# EAGLE design sequencer_main (EAGLE 8.2.2)
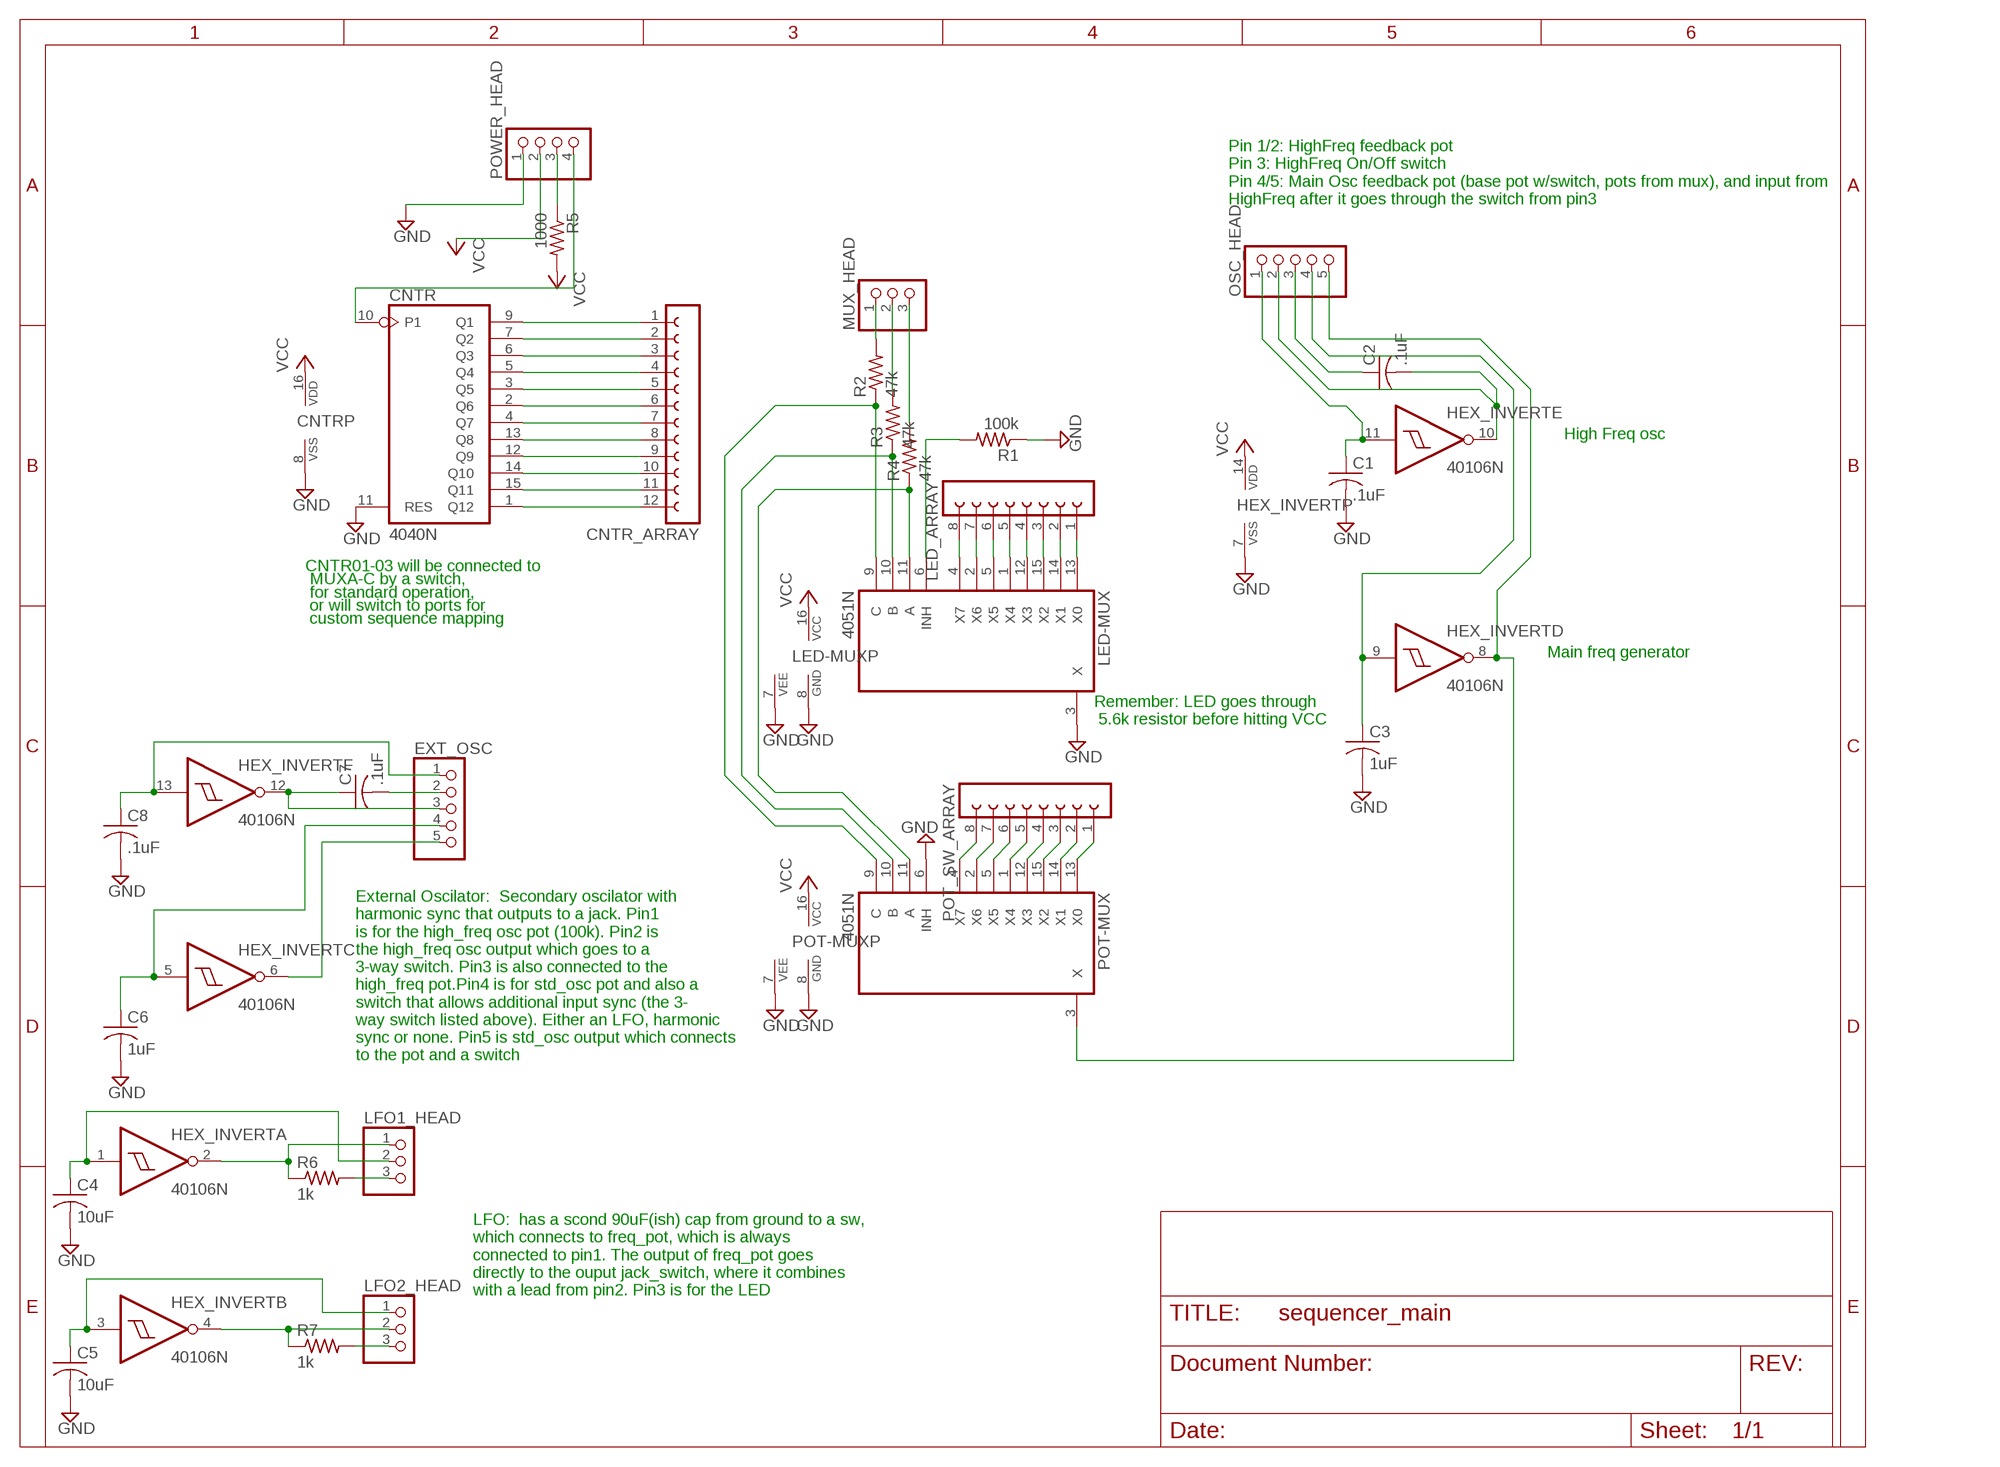
[diagram p0: schematic, sheet 1]

## Parts
C1  .1uF  C-US025-025X050  [C025-025X050]
C2  .1uF  C-US025-025X050  [C025-025X050]
C3  1uF  C-US025-025X050  [C025-025X050]
C4  10uF  C-US025-025X050  [C025-025X050]
C5  10uF  C-US025-025X050  [C025-025X050]
C6  1uF  C-US025-025X050  [C025-025X050]
C7  .1uF  C-US025-025X050  [C025-025X050]
C8  .1uF  C-US025-025X050  [C025-025X050]
CNTR  4040N  [DIL16]
CNTR_ARRAY  FE12-1  [FE12]
EXT_OSC  PINHD-1X5  [1X05]
HEX_INVERT  40106N  [DIL14]
LED-MUX  4051N  [DIL16]
LED_ARRAY  FE08-1  [FE08]
LFO1_HEAD  PINHD-1X3  [1X03]
LFO2_HEAD  PINHD-1X3  [1X03]
MUX_HEAD  PINHD-1X3  [1X03]
OSC_HEAD  PINHD-1X5  [1X05]
POT-MUX  4051N  [DIL16]
POT_SW_ARRAY  FE08-1  [FE08]
POWER_HEAD  PINHD-1X4  [1X04]
R1  100k  R-US_0204/7  [0204/7]
R2  47k  R-US_0204/7  [0204/7]
R3  47k  R-US_0204/7  [0204/7]
R4  47k  R-US_0204/7  [0204/7]
R5  1000  R-US_0204/7  [0204/7]
R6  1k  R-US_0204/7  [0204/7]
R7  1k  R-US_0204/7  [0204/7]

## Nets
GND: C1.2 C3.2 C4.2 C5.2 C6.2 C8.2 CNTR.8(VSS) CNTR.11(RES) HEX_INVERT.7(P:VSS) LED-MUX.3(X) LED-MUX.7(VEE) LED-MUX.8(GND) POT-MUX.6(INH) POT-MUX.7(VEE) POT-MUX.8(GND) POWER_HEAD.1 R1.1
N$1: LED-MUX.13(X0) LED_ARRAY.1
N$2: LED-MUX.14(X1) LED_ARRAY.2
N$3: LED-MUX.15(X2) LED_ARRAY.3
N$4: LED-MUX.12(X3) LED_ARRAY.4
N$5: LED-MUX.1(X4) LED_ARRAY.5
N$6: LED-MUX.5(X5) LED_ARRAY.6
N$7: LED-MUX.2(X6) LED_ARRAY.7
N$8: LED-MUX.4(X7) LED_ARRAY.8
N$9: LED-MUX.9(C) POT-MUX.9(C) R2.1
N$10: LED-MUX.10(B) POT-MUX.10(B) R3.1
N$11: LED-MUX.11(A) POT-MUX.11(A) R4.1
N$12: CNTR.10(P1) POWER_HEAD.4
N$13: CNTR.9(Q1) CNTR_ARRAY.1
N$14: CNTR.7(Q2) CNTR_ARRAY.2
N$15: CNTR.6(Q3) CNTR_ARRAY.3
N$16: CNTR.5(Q4) CNTR_ARRAY.4
N$17: CNTR.3(Q5) CNTR_ARRAY.5
N$18: CNTR.2(Q6) CNTR_ARRAY.6
N$19: CNTR.4(Q7) CNTR_ARRAY.7
N$20: CNTR.1(Q12) CNTR_ARRAY.12
N$21: CNTR.15(Q11) CNTR_ARRAY.11
N$22: CNTR.14(Q10) CNTR_ARRAY.10
N$23: CNTR.12(Q9) CNTR_ARRAY.9
N$24: CNTR.13(Q8) CNTR_ARRAY.8
N$25: MUX_HEAD.1 R2.2
N$26: MUX_HEAD.2 R3.2
N$27: MUX_HEAD.3 R4.2
N$28: LED-MUX.6(INH) R1.2
N$29: POT-MUX.4(X7) POT_SW_ARRAY.8
N$30: POT-MUX.2(X6) POT_SW_ARRAY.7
N$31: POT-MUX.5(X5) POT_SW_ARRAY.6
N$32: POT-MUX.1(X4) POT_SW_ARRAY.5
N$33: POT-MUX.12(X3) POT_SW_ARRAY.4
N$34: POT-MUX.15(X2) POT_SW_ARRAY.3
N$35: POT-MUX.14(X1) POT_SW_ARRAY.2
N$36: POT-MUX.13(X0) POT_SW_ARRAY.1
N$37: POWER_HEAD.3 R5.1
N$38: C3.1 HEX_INVERT.9(D:I) OSC_HEAD.4
N$39: C1.1 HEX_INVERT.11(E:I) OSC_HEAD.1
N$40: C2.2 HEX_INVERT.10(E:O) OSC_HEAD.2
N$41: HEX_INVERT.8(D:O) OSC_HEAD.5 POT-MUX.3(X)
N$42: C7.2 EXT_OSC.2
N$43: HEX_INVERT.2(A:O) LFO1_HEAD.1 R6.1
N$44: LFO1_HEAD.3 R6.2
N$45: C4.1 HEX_INVERT.1(A:I) LFO1_HEAD.2
N$46: HEX_INVERT.4(B:O) LFO2_HEAD.2 R7.1
N$47: C5.1 HEX_INVERT.3(B:I) LFO2_HEAD.1
N$48: LFO2_HEAD.3 R7.2
N$49: C2.1 OSC_HEAD.3
N$50: C8.1 EXT_OSC.1 HEX_INVERT.13(F:I)
N$51: C6.1 EXT_OSC.4 HEX_INVERT.5(C:I)
N$52: C7.1 EXT_OSC.3 HEX_INVERT.12(F:O)
N$53: EXT_OSC.5 HEX_INVERT.6(C:O)
VCC: CNTR.16(VDD) HEX_INVERT.14(P:VDD) LED-MUX.16(VCC) POT-MUX.16(VCC) POWER_HEAD.2 R5.2

## Notes on the sheet
- Pin 1/2: HighFreq feedback pot
  Pin 3: HighFreq On/Off switch
  Pin 4/5: Main Osc feedback pot (base pot w/switch, pots from mux), and input from 
  HighFreq after it goes through the switch from pin3
- High Freq osc
- CNTR01-03 will be connected to
   MUXA-C by a switch,
   for standard operation,
   or will switch to ports for
   custom sequence mapping
- Main freq generator
- Remember: LED goes through
   5.6k resistor before hitting VCC
- External Oscilator:  Secondary oscilator with
  harmonic sync that outputs to a jack. Pin1
  is for the high_freq osc pot (100k). Pin2 is 
  the high_freq osc output which goes to a 
  3-way switch. Pin3 is also connected to the
  high_freq pot.Pin4 is for std_osc pot and also a
  switch that allows additional input sync (the 3-
  way switch listed above). Either an LFO, harmonic
  sync or none. Pin5 is std_osc output which connects
  to the pot and a switch
- LFO:  has a scond 90uF(ish) cap from ground to a sw,
  which connects to freq_pot, which is always
  connected to pin1. The output of freq_pot goes
  directly to the ouput jack_switch, where it combines
  with a lead from pin2. Pin3 is for the LED

## Library data of the parts
C1-C8 = resistor:C-US: CAPACITOR, American symbol
CNTR = 40xx:4040: 12-stage binary/ripple COUNTER
CNTR_ARRAY = con-lsta:FE12-1: FEMALE HEADER; OC_FARNELL: unknown; OC_NEWARK: unknown
EXT_OSC OSC_HEAD = pinhead:PINHD-1X5: PIN HEADER
HEX_INVERT = 40xx:40106: Hex SCHMITT TRIGGER
LED-MUX POT-MUX = 40xx:4051: 8-channel ANALOG MULTIPLEXER
LED_ARRAY POT_SW_ARRAY = con-lsta:FE08-1: FEMALE HEADER; OC_FARNELL: unknown; OC_NEWARK: unknown
LFO1_HEAD LFO2_HEAD MUX_HEAD = pinhead:PINHD-1X3: PIN HEADER
POWER_HEAD = pinhead:PINHD-1X4: PIN HEADER
R1-R7 = resistor:R-US_: RESISTOR, American symbol

## Board
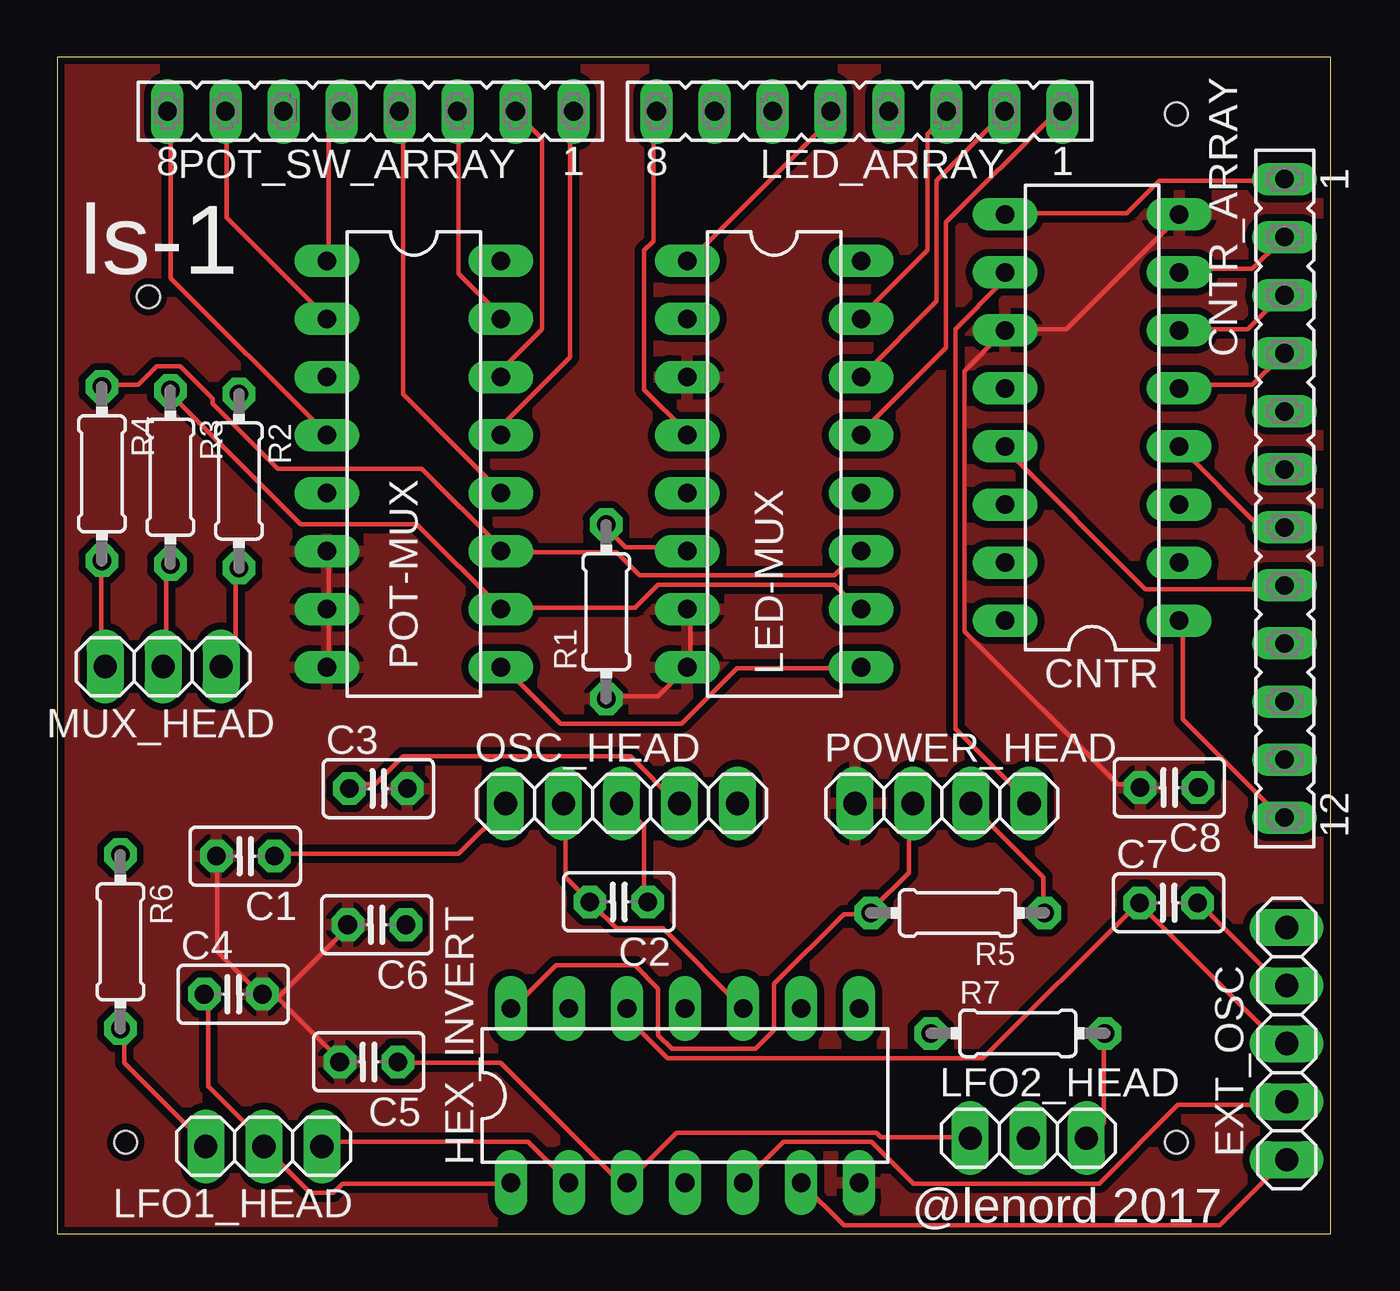
[diagram p1: board, top side]
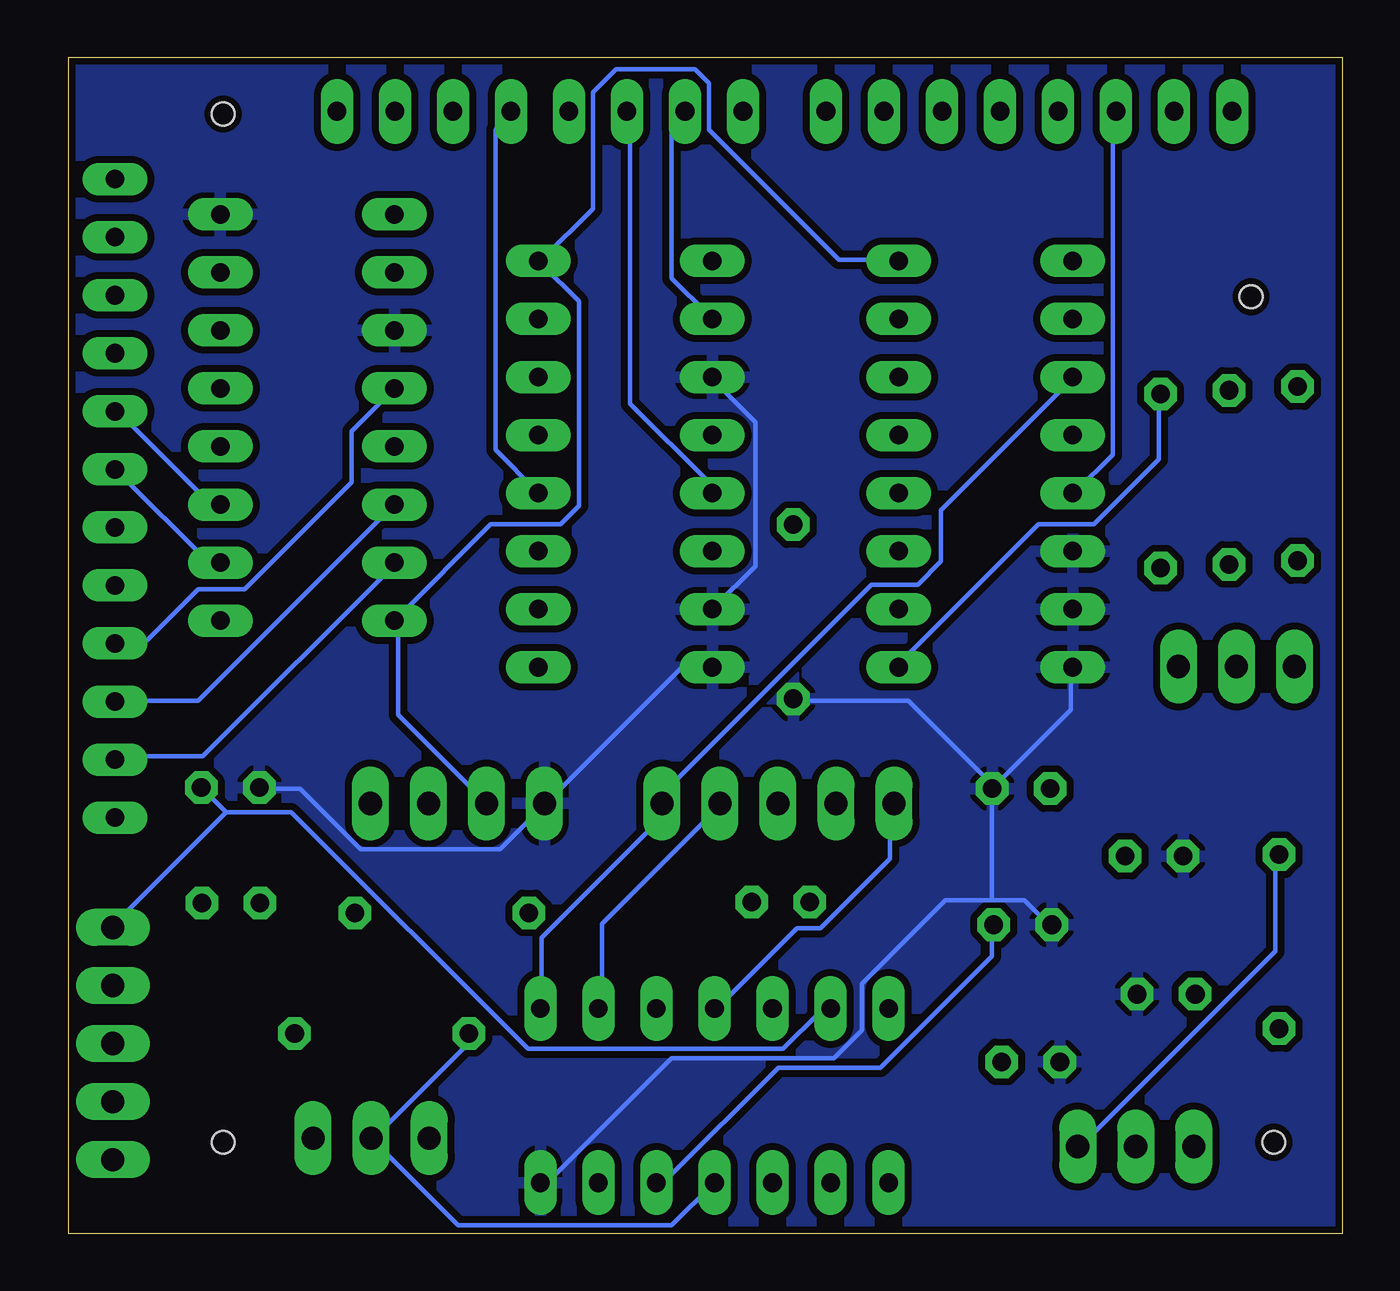
[diagram p2: board, bottom side, seen from below]

Size 55.76 x 51.49 mm. Coordinates in mm from the lower left corner, seen from the top.
Outline: 0,0 55.76,0 55.76,51.49 0,51.49 0,0
Copper layers (1*16): Top 0.035mm / dielectric 1.5mm / Bottom 0.035mm
Design rules "SparkFun": minimum track width 8mil, minimum drill 20mil, track to track 8mil, track to pad 8mil, pad to pad 8mil, via to via 8mil, smd to smd 8mil, copper to edge 8mil, drill to drill 8mil, minimum pad ring 12mil, minimum via ring 10mil, stop-mask expansion 4mil, vias tented up to drill 20mil, thermal gap 10mil
Holes 1 mm at 49,4 3,4 4,41 49,49

### Footprints (pad centres in the part's own frame; a part is rotated, then mirrored left to right if it is on the bottom)
C025-025X050 = drill 0.813 octagon: 1 -1.27,0; 2 1.27,0
DIL16 = drill 0.813 long: 1 -8.89,-3.81; 2 -6.35,-3.81; 3 -3.81,-3.81; 4 -1.27,-3.81; 5 1.27,-3.81; 6 3.81,-3.81; 7 6.35,-3.81; 8 8.89,-3.81; 9 8.89,3.81; 10 6.35,3.81; 11 3.81,3.81; 12 1.27,3.81; 13 -1.27,3.81; 14 -3.81,3.81; 15 -6.35,3.81; 16 -8.89,3.81
FE12 = drill 0.813 long: 1 -13.97,0; 2 -11.43,0; 3 -8.89,0; 4 -6.35,0; 5 -3.81,0; 6 -1.27,0; 7 1.27,0; 8 3.81,0; 9 6.35,0; 10 8.89,0; 11 11.43,0; 12 13.97,0
1X05 = drill 1.016 long: 1 -5.08,0; 2 -2.54,0; 3 0,0; 4 2.54,0; 5 5.08,0
DIL14 = drill 0.813 long: 1 -7.62,-3.81; 2 -5.08,-3.81; 3 -2.54,-3.81; 4 0,-3.81; 5 2.54,-3.81; 6 5.08,-3.81; 7 7.62,-3.81; 8 7.62,3.81; 9 5.08,3.81; 10 2.54,3.81; 11 0,3.81; 12 -2.54,3.81; 13 -5.08,3.81; 14 -7.62,3.81
FE08 = drill 0.813 long: 1 -8.89,0; 2 -6.35,0; 3 -3.81,0; 4 -1.27,0; 5 1.27,0; 6 3.81,0; 7 6.35,0; 8 8.89,0
1X03 = drill 1.016 long: 1 -2.54,0; 2 0,0; 3 2.54,0
1X04 = drill 1.016 long: 1 -3.81,0; 2 -1.27,0; 3 1.27,0; 4 3.81,0
0204/7 = drill 0.813 octagon: 1 -3.81,0; 2 3.81,0

### Placement (x,y rotation side)
C1  8.24,16.52 180 top
C2  24.59,14.52 180 top
C3  14.06,19.48 0 top
C4  7.71,10.48 0 top
C5  13.64,7.52 180 top
C6  13.99,13.52 180 top
C7  48.66,14.48 0 top
C8  48.69,19.52 180 top
CNTR  45.31,35.72 90 top
CNTR_ARRAY  53.74,32.18 270 top
EXT_OSC  53.83,8.32 270 top
HEX_INVERT  27.49,6.04 0 top
LED-MUX  31.39,33.68 270 top
LED_ARRAY  35.13,49.12 180 top
LFO1_HEAD  9.05,3.82 180 top
LFO2_HEAD  42.52,4.18 0 top
MUX_HEAD  4.64,24.82 180 top
OSC_HEAD  24.71,18.83 0 top
POT-MUX  15.62,33.68 270 top
POT_SW_ARRAY  13.72,49.12 180 top
POWER_HEAD  38.74,18.83 0 top
R1  24.04,27.22 90 top
R2  7.96,32.94 270 top
R3  4.96,33.1 270 top
R4  1.96,33.26 270 top
R5  39.42,14.04 180 top
R6  2.77,12.78 270 top
R7  42.06,8.77 0 top

### Tracks (layer width: path | path; a pad name or v marks a point on that pad's centre or on a via)
GND
  Top 0.203: R1.1 24.08,23.53 26.31,23.53 27.53,24.75 LED-MUX.8 27.74,24.95 27.74,27.19 LED-MUX.7 | CNTR.8 49.07,44.46 44.2,39.58 41.55,39.58 CNTR.11 41.35,39.38 39.73,37.75 39.73,26.37 46.43,19.67 47.24,19.67 C8.2 | POT-MUX.8 11.89,24.95 11.89,27.19 POT-MUX.7 11.89,27.39 11.89,29.83 POT-MUX.6 | 9.65,10.32 9.04,10.32 C4.2 | 9.65,10.32 12.29,7.68 C5.2 | C1.2 7.01,16.42 7.01,12.35 8.84,10.52 C4.2 | 9.65,10.32 12.7,13.37 C6.2 | 9.65,10.32 C4.2
  Bottom 0.203: LED-MUX.3 27.53,37.35 25.7,35.52 25.7,29.22 27.53,27.39 LED-MUX.7 | C8.2 47.24,19.46 45.62,19.46 42.98,16.82 36.88,16.82 35.05,18.65 POWER_HEAD.1 34.85,18.85 28.95,24.75 27.74,24.75 LED-MUX.8 | 15.34,14.59 13.92,14.59 12.9,13.57 C6.2 | 15.34,14.59 17.37,14.59 21.03,10.93 21.03,8.9 22.25,7.68 29.36,7.68 34.65,2.39 35.05,2.39 HEX_INVERT.7 | 15.34,14.59 15.34,19.46 C3.2 | POT-MUX.8 11.89,24.75 11.89,22.92 15.14,19.67 C3.2 | R1.1 23.88,23.33 19,23.33 15.34,19.67 C3.2
  pour Top (isolate 0.305): 0,0 56,0 56,51 0,51
  pour Bottom (isolate 0.305): 0,0 56,0 56,51 0,51
N$1
  Top 0.203: LED-MUX.13 35.25,35.11 38.91,38.77 38.91,44.25 43.59,48.93 43.99,48.93 LED_ARRAY.1
N$2
  Top 0.203: LED-MUX.14 35.25,37.55 38.51,40.8 38.51,46.08 41.35,48.93 LED_ARRAY.2
N$3
  Top 0.203: LED-MUX.15 35.25,40.19 38.1,43.03 38.1,48.12 38.91,48.93 LED_ARRAY.3
N$4
  Bottom 0.203: LED-MUX.12 35.25,32.47 37.08,34.3 37.08,48.32 36.47,48.93 LED_ARRAY.4
N$5
  Top 0.203: LED-MUX.1 27.74,42.63 34.03,48.93 LED_ARRAY.5
N$6
  Bottom 0.203: LED-MUX.5 27.74,32.47 27.74,32.88 31.19,36.33 31.19,48.93 LED_ARRAY.6
N$7
  Bottom 0.203: LED-MUX.2 27.74,40.19 29.36,41.82 29.36,48.52 28.95,48.93 LED_ARRAY.7
N$8
  Top 0.203: LED_ARRAY.8 26.11,48.93 26.11,43.44 25.7,43.03 25.7,36.94 27.53,35.11 LED-MUX.4
N$9
  Top 0.203: LED-MUX.9 35.05,24.75 29.77,24.75 27.33,22.31 22.05,22.31 19.61,24.75 POT-MUX.9
  Bottom 0.203: R2.1 8.03,36.74 8.03,33.89 10.87,31.05 13.31,31.05 19.41,24.95 POT-MUX.9
N$10
  Top 0.203: LED-MUX.10 35.05,27.39 34.03,28.41 26.31,28.41 25.3,27.39 19.61,27.39 POT-MUX.10 19.41,27.39 15.75,31.05 10.67,31.05 4.98,36.74 R3.1
N$11
  Top 0.203: LED-MUX.11 35.05,29.83 34.03,28.81 25.5,28.81 24.48,29.83 19.61,29.83 POT-MUX.11 19.41,30.03 15.95,33.48 9.65,33.48 6.81,36.33 6.81,36.53 5.38,37.95 4.37,37.95 3.55,37.14 2.13,37.14 R4.1
N$12
  Top 0.203: CNTR.10 41.35,42.02 41.35,41.61 39.32,39.58 39.32,22.11 42.57,18.85 POWER_HEAD.4
N$13
  Top 0.203: CNTR.9 41.55,44.66 46.84,44.66 48.26,46.08 53.54,46.08 CNTR_ARRAY.1
N$14
  Top 0.203: CNTR.7 49.28,42.22 52.32,42.22 53.54,43.44 CNTR_ARRAY.2
N$15
  Top 0.203: CNTR.6 49.28,39.58 52.12,39.58 53.54,41 CNTR_ARRAY.3
N$16
  Top 0.203: CNTR.5 49.28,37.14 52.32,37.14 53.54,38.36 CNTR_ARRAY.4
N$17
  Bottom 0.203: CNTR.3 49.28,32.06 49.68,32.06 53.54,35.92 CNTR_ARRAY.5
N$18
  Bottom 0.203: CNTR.2 49.28,29.42 49.68,29.42 53.54,33.28 CNTR_ARRAY.6
N$19
  Top 0.203: CNTR_ARRAY.7 53.54,31.05 52.53,31.05 49.28,34.3 CNTR.4
N$20
  Top 0.203: CNTR.1 49.28,26.78 49.28,22.51 53.54,18.25 CNTR_ARRAY.12
N$21
  Bottom 0.203: CNTR_ARRAY.11 53.54,20.89 49.89,20.89 41.55,29.22 CNTR.15
N$22
  Bottom 0.203: CNTR_ARRAY.10 53.54,23.33 50.09,23.33 41.55,31.86 CNTR.14
N$23
  Bottom 0.203: CNTR_ARRAY.9 53.54,25.97 52.32,25.97 50.09,28.2 48.06,28.2 43.38,32.88 43.38,35.11 41.55,36.94 CNTR.12
N$24
  Top 0.203: CNTR_ARRAY.8 53.54,28.2 47.65,28.2 41.55,34.3 CNTR.13
N$25
  Top 0.203: R2.2 7.82,29.01 7.82,25.56 7.21,24.95 MUX_HEAD.1
N$26
  Top 0.203: R3.2 4.77,29.22 4.77,24.95 MUX_HEAD.2
N$27
  Top 0.203: R4.2 1.93,29.42 1.93,24.95 MUX_HEAD.3
N$28
  Top 0.203: LED-MUX.6 27.53,30.03 24.89,30.03 24.08,30.84 R1.2
N$29
  Top 0.203: POT_SW_ARRAY.8 4.98,48.93 4.98,41.82 11.68,35.11 POT-MUX.4
N$30
  Top 0.203: POT_SW_ARRAY.7 7.42,48.93 7.42,44.46 11.68,40.19 POT-MUX.2
N$31
  Bottom 0.203: POT_SW_ARRAY.6 10.06,48.93 10.06,34.09 11.68,32.47 POT-MUX.5
N$32
  Top 0.203: POT-MUX.1 11.89,42.63 11.89,48.52 12.29,48.93 POT_SW_ARRAY.5
N$33
  Top 0.203: POT_SW_ARRAY.4 15.14,48.93 15.14,36.74 19.41,32.47 POT-MUX.12
N$34
  Top 0.203: POT_SW_ARRAY.3 17.58,48.93 17.58,42.02 19.41,40.19 POT-MUX.15
N$35
  Top 0.203: POT-MUX.14 19.61,37.55 19.61,37.95 21.23,39.58 21.23,47.91 20.22,48.93 POT_SW_ARRAY.2
N$36
  Top 0.203: POT-MUX.13 19.61,35.11 19.61,35.52 22.45,38.36 22.45,48.93 POT_SW_ARRAY.1
N$37
  Top 0.203: R5.1 43.18,14.18 43.18,15.6 40.13,18.65 POWER_HEAD.3
N$38
  Top 0.203: C3.1 12.9,19.67 13.92,19.67 15.14,20.89 25.09,20.89 27.13,18.85 OSC_HEAD.4
  Bottom 0.203: HEX_INVERT.9 32.41,9.91 32.41,13.57 27.33,18.65 OSC_HEAD.4
N$39
  Top 0.203: C1.1 9.65,16.62 17.58,16.62 19.61,18.65 OSC_HEAD.1
  Bottom 0.203: HEX_INVERT.11 27.33,9.91 23.88,13.37 22.86,13.37 19.81,16.42 19.81,18.65 OSC_HEAD.1
N$40
  Top 0.203: HEX_INVERT.10 29.97,9.91 26.52,13.37 24.48,13.37 23.47,14.38 C2.2 23.27,14.59 22.25,15.6 22.25,18.65 OSC_HEAD.2
N$41
  Bottom 0.203: POT-MUX.3 11.89,37.35 17.58,31.66 17.58,29.42 18.59,28.41 20.62,28.41 29.77,19.26 29.77,18.85 OSC_HEAD.5 29.97,18.65 29.97,18.04 35.05,12.96 35.05,9.91 HEX_INVERT.8
N$42
  Top 0.203: C7.2 50.09,14.38 53.75,10.73 EXT_OSC.2
N$43
  Top 0.203: HEX_INVERT.2 22.25,2.39 20.62,4.02 11.68,4.02 LFO1_HEAD.1
  Bottom 0.203: R6.1 2.95,16.42 2.95,12.35 11.48,3.82 LFO1_HEAD.1
N$44
  Top 0.203: R6.2 2.95,8.9 2.95,7.48 6.4,4.02 LFO1_HEAD.3
N$45
  Top 0.203: C4.1 6.6,10.32 6.6,6.46 9.04,4.02 LFO1_HEAD.2 11.07,1.79 12.09,1.79 12.5,2.19 19.81,2.19 HEX_INVERT.1
N$46
  Bottom 0.203: HEX_INVERT.4 27.53,2.19 29.36,0.36 38.71,0.36 42.37,4.02 LFO2_HEAD.2 42.37,4.22 38.3,8.29 38.3,8.69 R7.1
N$47
  Top 0.203: C5.1 14.93,7.48 19.41,7.48 24.48,2.39 24.89,2.39 HEX_INVERT.3 25.09,2.39 27.13,4.43 35.86,4.43 36.07,4.22 39.93,4.22 LFO2_HEAD.1
N$48
  Top 0.203: R7.2 45.82,8.69 45.82,4.83 45.21,4.22 LFO2_HEAD.3
N$49
  Top 0.203: C2.1 25.7,14.59 25.7,17.84 24.89,18.65 OSC_HEAD.3
N$50
  Bottom 0.203: 48.87,18.45 46.02,18.45 35.66,8.09 24.48,8.09 22.86,9.71 22.45,9.71 HEX_INVERT.13 | 48.87,18.45 49.89,19.46 C8.1 | 48.87,18.45 53.75,13.57 EXT_OSC.1
N$51
  Top 0.203: EXT_OSC.4 53.75,5.65 49.07,5.65 45.62,2.19 37.49,2.19 35.66,4.02 31.8,4.02 30.17,2.39 HEX_INVERT.5
  Bottom 0.203: HEX_INVERT.5 29.97,2.39 29.56,2.39 24.69,7.27 20.22,7.27 15.34,12.15 15.34,13.37 C6.1
N$52
  Top 0.203: HEX_INVERT.12 25.09,9.71 25.09,9.3 26.72,7.68 40.54,7.68 47.24,14.38 C7.1 47.45,14.38 53.34,8.49 53.75,8.49 EXT_OSC.3
N$53
  Top 0.203: HEX_INVERT.6 32.61,2.19 34.44,0.36 50.9,0.36 53.75,3.21 EXT_OSC.5
VCC
  Top 0.203: HEX_INVERT.14 20.01,9.91 21.84,11.74 25.3,11.74 26.31,10.73 26.31,8.69 26.92,8.09 30.58,8.09 31.39,8.9 31.39,10.93 34.44,13.98 35.46,13.98 R5.2 35.66,14.18 37.29,15.81 37.29,18.65 POWER_HEAD.2
  Bottom 0.203: POT-MUX.16 19.61,42.63 22.05,42.63 27.74,48.32 27.74,50.35 28.35,50.96 31.8,50.96 32.82,49.94 32.82,44.86 35.05,42.63 LED-MUX.16 35.05,42.43 33.43,40.8 33.43,31.86 34.24,31.05 37.29,31.05 41.35,26.98 CNTR.16 41.35,26.78 41.35,22.72 37.49,18.85 POWER_HEAD.2

### Text on the board
tPlace: ls-1 | @lenord 2017